# Altium schematic sheet Sheet2.SchDoc
size 381 x 241 mm
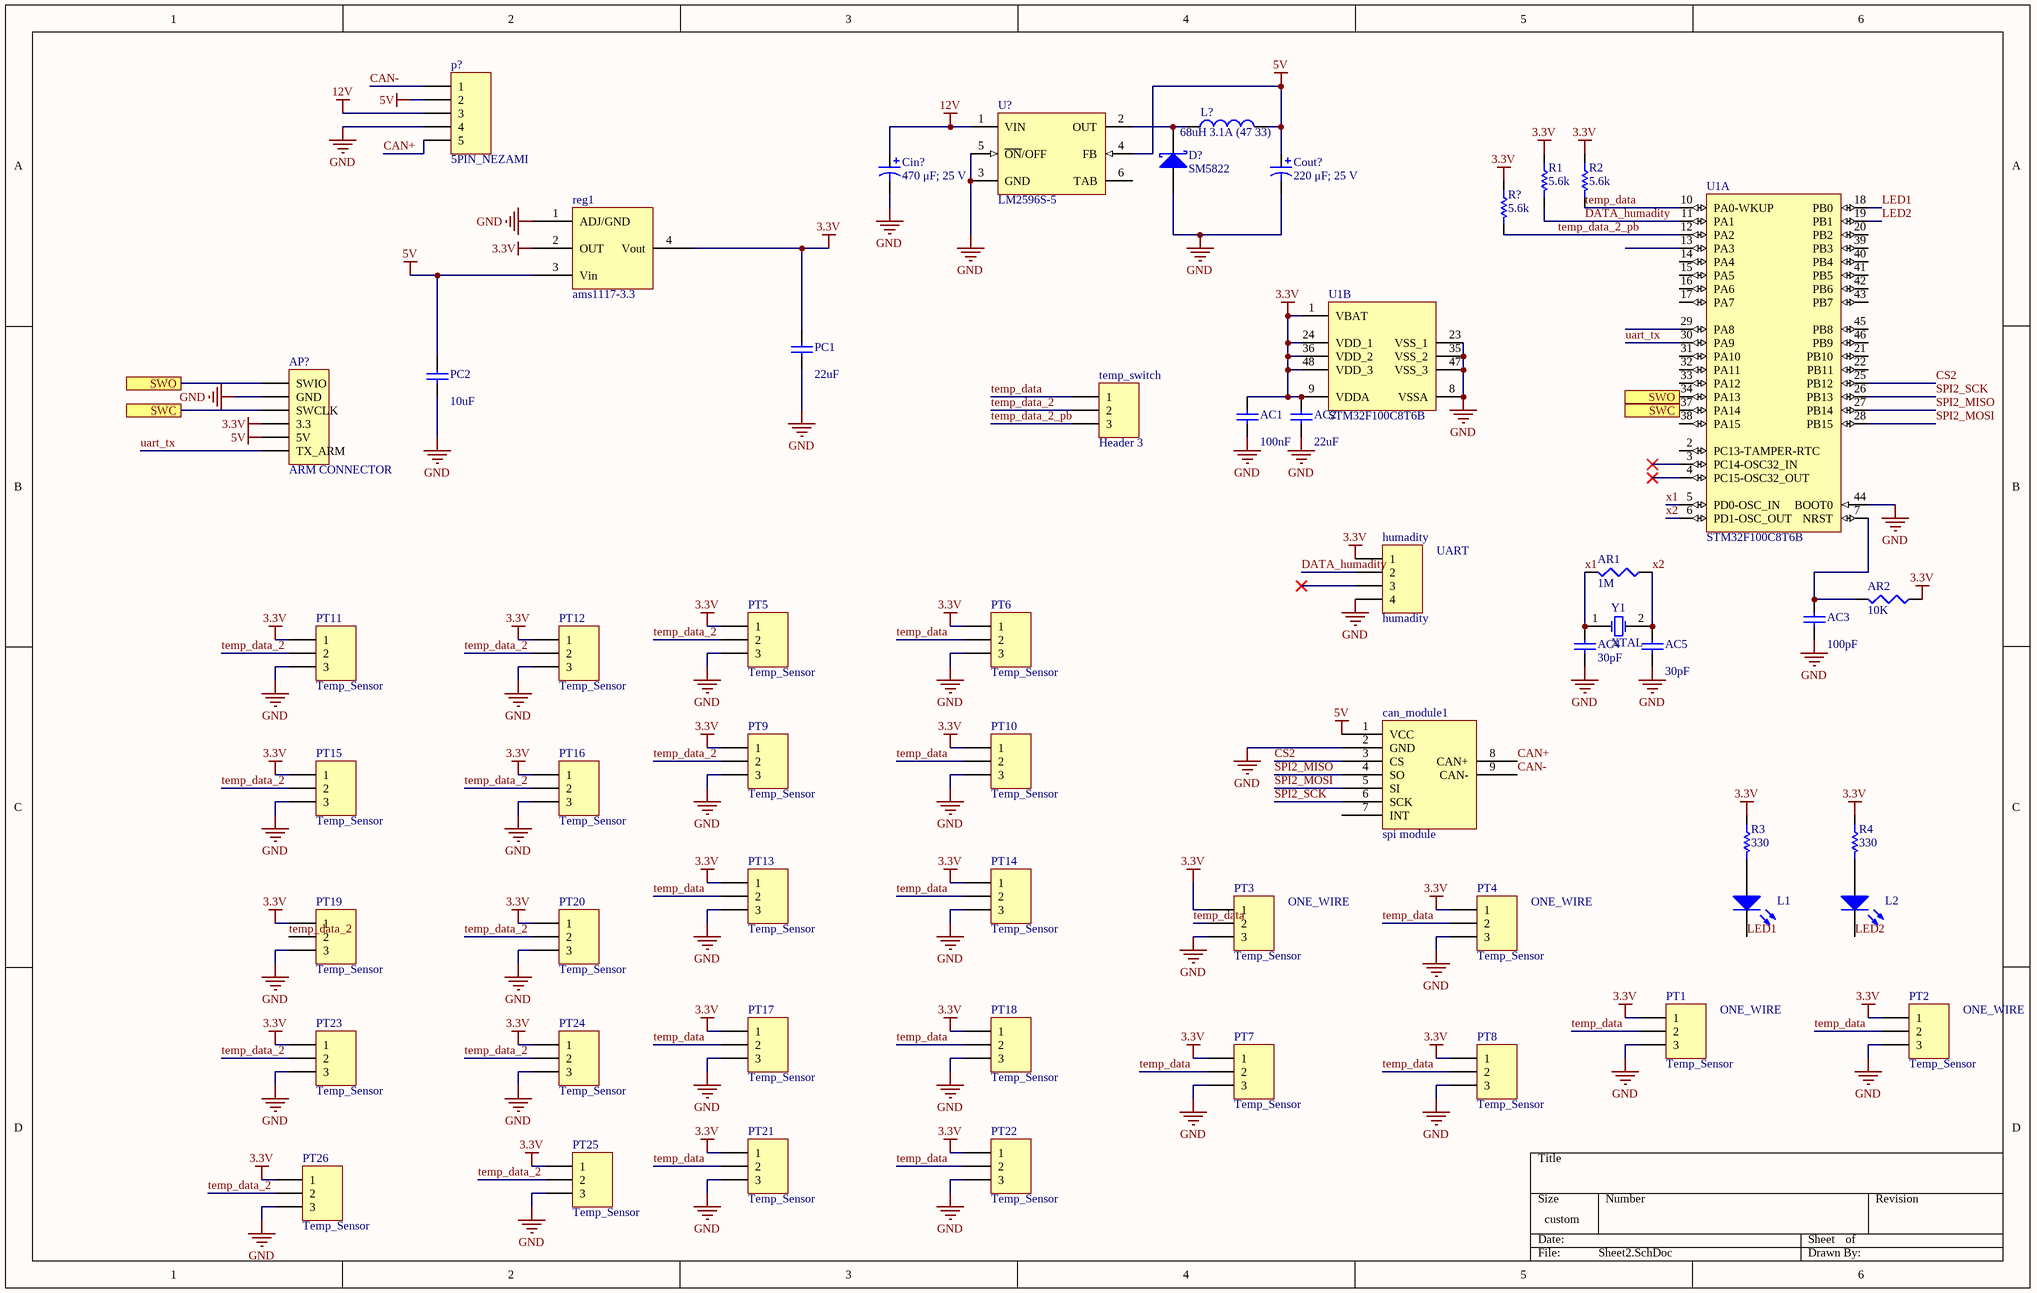
[diagram p0: Sheet2.SchDoc]

## Parts
AC1  value 100nF  [C1206]  (hidden comment: Cap Semi)
AC2  value 22uF  [C1206]  (hidden comment: Cap Semi)
AC3  value 100pF  [C1206]  (hidden comment: Cap Semi)
AC4  value 30pF  [C1206]  (hidden comment: Cap Semi)
AC5  value 30pF  [C1206]  (hidden comment: Cap Semi)
AP?  ARM CONNECTOR  [HDR1X6]
AR1  value 1M  [c1206]  (hidden comment: Res3)
AR2  value 10K  [c1206]  (hidden comment: Res3)
can_module1  spi module  [SPI_CAN]
Cin?  470 μF; 25 V  [E]
Cout?  220 μF; 25 V  [E]
D?  SM5822  [SMB]
humadity  humadity  [HDR1X4]
L1  LED2  [C1206]  (value not drawn)
L2  LED2  [C1206]  (value not drawn)
L?  68uH 3.1A (47 33)  [CAPR5-4X5]
p?  5PIN_NEZAMI  [5PIN_NEZAMI_CAN]
PC1  value 22uF  [C1206]  (hidden comment: Cap Semi)
PC2  value 10uF  [C1206]  (hidden comment: PC1)
PT1  Temp_Sensor  [HDR1X3]
PT2  Temp_Sensor  [HDR1X3]
PT3  Temp_Sensor  [HDR1X3]
PT4  Temp_Sensor  [HDR1X3]
PT5  Temp_Sensor  [HDR1X3]
PT6  Temp_Sensor  [HDR1X3]
PT7  Temp_Sensor  [HDR1X3]
PT8  Temp_Sensor  [HDR1X3]
PT9  Temp_Sensor  [HDR1X3]
PT10  Temp_Sensor  [HDR1X3]
PT11  Temp_Sensor  [HDR1X3]
PT12  Temp_Sensor  [HDR1X3]
PT13  Temp_Sensor  [HDR1X3]
PT14  Temp_Sensor  [HDR1X3]
PT15  Temp_Sensor  [HDR1X3]
PT16  Temp_Sensor  [HDR1X3]
PT17  Temp_Sensor  [HDR1X3]
PT18  Temp_Sensor  [HDR1X3]
PT19  Temp_Sensor  [HDR1X3]
PT20  Temp_Sensor  [HDR1X3]
PT21  Temp_Sensor  [HDR1X3]
PT22  Temp_Sensor  [HDR1X3]
PT23  Temp_Sensor  [HDR1X3]
PT24  Temp_Sensor  [HDR1X3]
PT25  Temp_Sensor  [HDR1X3]
PT26  Temp_Sensor  [HDR1X3]
R1  5.6k  [1206]
R2  5.6k  [1206]
R3  330  [1206]
R4  330  [1206]
R?  5.6k  [1206]
reg1  ams1117-3.3  [SOT223_N]
temp_switch  Header 3  [HDR1X3]
U1  STM32F100C8T6B  [STM-LQFP48_N]  (parts A,B of 2)
U?  LM2596S-5  [TS5B_N]
Y1  XTAL  [RAD-0.2]

## Ports
SWC, SWO

## Nets
3.3V: AC1.1 AC2.1 AP?.4(3.3) AR2.1 humadity.1 PC1.1 PT1.1 PT2.1 PT3.1 PT4.1 PT5.1 PT6.1 PT7.1 PT8.1 PT9.1 PT10.1 PT11.1 PT12.1 PT13.1 PT14.1 PT15.1 PT16.1 PT17.1 PT18.1 PT19.1 PT20.1 PT21.1 PT22.1 PT23.1 PT24.1 PT25.1 PT26.1 R1.1 R2.1 R3.1 R4.1 R?.1 reg1.2(OUT) reg1.4(Vout) U1.1(VBAT) U1.9(VDDA) U1.24(VDD_1) U1.36(VDD_2) U1.48(VDD_3)
5V: AP?.5(5V) can_module1.1(VCC) Cout?.1 L?.2 p?.2 PC2.1 reg1.3(Vin) U?.4(FB)
12V: Cin?.1 p?.3 U?.1(VIN)
GND: AC1.2 AC2.2 AC3.2 AC4.2 AC5.2 AP?.2(GND) can_module1.2(GND) Cin?.2 Cout?.2 D?.1(A) humadity.4 p?.4 PC1.2 PC2.2 PT1.3 PT2.3 PT3.3 PT4.3 PT5.3 PT6.3 PT7.3 PT8.3 PT9.3 PT10.3 PT11.3 PT12.3 PT13.3 PT14.3 PT15.3 PT16.3 PT17.3 PT18.3 PT19.3 PT20.3 PT21.3 PT22.3 PT23.3 PT24.3 PT25.3 PT26.3 reg1.1(ADJ/GND) U1.8(VSSA) U1.23(VSS_1) U1.35(VSS_2) U1.44(BOOT0) U1.47(VSS_3) U?.3(GND) U?.5(~{ON}/OFF)
CAN+: can_module1.8(CAN+) p?.5
CAN-: can_module1.9(CAN-) p?.1
CS2: can_module1.3(CS) U1.25(PB12)
DATA_humadity: humadity.2 R1.2 U1.11(PA1)
LED1: L1.2(K) U1.18(PB0)
LED2: L2.2(K) U1.19(PB1)
SPI2_MISO: can_module1.4(SO) U1.27(PB14)
SPI2_MOSI: can_module1.5(SI) U1.28(PB15)
SPI2_SCK: can_module1.6(SCK) U1.26(PB13)
SWC: AP?.3(SWCLK) U1.37(PA14) ; port SWC
SWO: AP?.1(SWIO) U1.34(PA13) ; port SWO
temp_data: PT1.2 PT2.2 PT3.2 PT4.2 PT6.2 PT7.2 PT8.2 PT10.2 PT13.2 PT14.2 PT17.2 PT18.2 PT21.2 PT22.2 R2.2 temp_switch.1 U1.10(PA0-WKUP)
temp_data_2: PT5.2 PT9.2 PT11.2 PT12.2 PT15.2 PT16.2 PT19.2 PT20.2 PT23.2 PT24.2 PT25.2 PT26.2 temp_switch.2
temp_data_2_pb: R?.2 temp_switch.3 U1.12(PA2)
uart_tx: AP?.6(TX_ARM) U1.30(PA9)
x1: AC4.1 AR1.2 U1.5(PD0-OSC_IN) Y1.1(OSC1)
x2: AC5.1 AR1.1 U1.6(PD1-OSC_OUT) Y1.2(OSC2)
NetAC3_1: AC3.1 AR2.2 U1.7(NRST)
NetD?_2: D?.2(K) L?.1 U?.2(OUT)
NetL1_1: L1.1(A) R3.2
NetL2_1: L2.1(A) R4.2

Not connected (* = marked no-connect by the designer): can_module1 7(INT); humadity 3*; U1 2(PC13-TAMPER-RTC) 3(PC14-OSC32_IN)* 4(PC15-OSC32_OUT)* 13(PA3) 14(PA4) 15(PA5) 16(PA6) 17(PA7) 20(PB2) 21(PB10) 22(PB11) 29(PA8) 31(PA10) 32(PA11) 33(PA12) 38(PA15) 39(PB3) 40(PB4) 41(PB5) 42(PB6) 43(PB7) 45(PB8) 46(PB9); U? 6(TAB)

## Notes on the sheet
- UART
- ONE_WIRE

## Library data of the parts
AC1-AC5 PC1 PC2 = Cap Semi: Capacitor (Semiconductor SIM Model); Published: 8-Jun-2000; LatestRevisionDate: 29-May-2009; LatestRevisionNote: IPC-7351 Footprint Added.; PackageReference: C1206; Publisher: Altium Limited; PackageDescription: Chip Capacitor
AP? = Header 6: Header, 6-Pin; LatestRevisionDate: 17-Jul-2002; LatestRevisionNote: Re-released for DXP Platform.; Publisher: Altium Limited
AR1 AR2 = Res3: Resistor; Published: 8-Jun-2000; LatestRevisionDate: 29-May-2009; LatestRevisionNote: IPC-7351 Footprint Added.; PackageReference: J1-0603; Publisher: Altium Limited; PackageDescription: Chip Resistor
Cin? Cout? = 94SH107X0016EBP: Solid Aluminum Capacitor with Organic Semiconductor Electrolyte: 100uF, 16V, Bulk Pack; Note: Part Numbers shown are for ± 20% capacitance tolerance (X0).; PCB_Layout: Complies with Manufacturer's Recommendation.; DrillSize: Nominal, Rounded to the nearest 0.1mm; Published: 19-Mar-2004; DatasheetDocument: 23-May-2001; PackageReference: E; Publisher: Altium Limited; ComponentLink1Description: Manufacturer Link; ComponentLink1URL: http://www.vishay.com/; ComponentLink2Description: Datasheet; ComponentLink2URL: http://www.vishay.com/docs/90006/94sh.pdf; Value: 100uF
D? = D Schottky: Schottky Diode; Published: 8-Jun-2000; LatestRevisionDate: 17-Jul-2002; LatestRevisionNote: Re-released for DXP Platform.; PackageReference: SMB; Publisher: Altium Limited; PackageDescription: DO-214-AA/SMB; 2 C-Bend Leads; Body 5.3 x 3.6 mm, inc. leads (LxW); Code_JEDEC: DO-214-AA
humadity = Header 4: Header, 4-Pin; LatestRevisionDate: 17-Jul-2002; LatestRevisionNote: Re-released for DXP Platform.; Publisher: Altium Limited
L1 L2 = LED2: Typical RED, GREEN, YELLOW, AMBER GaAs LED; Published: 8-Jun-2000; LatestRevisionDate: 17-Jul-2002; LatestRevisionNote: Re-released for DXP Platform.; PackageVersion: Feb-2002; PackageReference: 3.2X1.6X1.1; Publisher: Altium Limited; PackageDescription: SM LED; 2 Flat Leads
L? = Inductor: Code_IEC: 1005; Value: 10mH; Published: 8-Jun-2000; LatestRevisionDate: 29-May-2009; LatestRevisionNote: IPC-7351 Footprint Added.; PackageReference: 0402-A; Publisher: Altium Limited; PackageDescription: Chip Inductor; Code_JEITA: 0402
p? = 5PIN_NEZAMI: Header, 8-Pin; LatestRevisionDate: 17-Jul-2002; LatestRevisionNote: Re-released for DXP Platform.; Publisher: Altium Limited
PT1-PT26 temp_switch = Header 3: Header, 3-Pin; LatestRevisionDate: 17-Jul-2002; LatestRevisionNote: Re-released for DXP Platform.; Publisher: Altium Limited
R1-R4 R? = Resistor
  R1 R2 R?: Value: 5.6k
  R3 R4: Value: 330
U1 = STM32F100C8T6B: ARM Cortex-M3 32-bit MCU, 64 KB Flash, 8 KB Internal RAM, 37 I/Os, 48-pin LQFP, -40 to 85 degC, Tray; A/D Converter: 1x12-bit (10 Channel); D/A Converter: 2x12-bit (2 Channel); FLASH Size (Prog) (kB): 64; I/Os (High Current): 37; Internal RAM Size (kB): 8; Operating Frequency(F) (Processor speed) (MHz): 24; Supply Voltage(Vcc) min (V): 2; DatasheetVersion: Rev. 7; PackageVersion: Rev. 6, 06/2013; PackageReference: LQFP48; PackageDescription: 48-Pin Low Profile Quad Flat Package, 7 x 7 mm Body, 0.5 mm Pitch; Supplier 1: Digi-Key; Supplier Part Number 1: 497-10499-ND; Supplier 2: Farnell; Supplier Part Number 2: 1838511; Supplier 3: Newark; Supplier Part Number 3: 76R0988; Supplier 4: Mouser; Supplier Part Number 4: 511-STM32F100C8T6B; Core: ARM Cortex-M3; Packing: Tray; Mounting Technology: Surface Mount; PartNumber: STM32F100C8T6B; ComponentLink1Description: Manufacturer URL; ComponentLink1URL: http://www.st.com/web/en/home.html; ComponentLink2Description: Datasheet; ComponentLink2URL: http://www.st.com/st-web-ui/static/active/en/resource/technical/document/datasheet/CD00251732.pdf; ComponentLink3Description: Package Specification; ComponentLink3URL: http://www.st.com/st-web-ui/static/active/en/resource/technical/document/datasheet/DM00058181.pdf
U? = LM2596S-ADJ: SIMPLE SWITCHER® Power Converter 150 KHz 3A Step-Down Voltage Regulator, 5-pin TO-263; Manufacturer: National Semiconductor; PackageTopMarking: NSUZXYTTE#*LM2596S*-ADJ P+; PowerWise: N; Published: 4-Dec-2008; DatasheetVersion: May-2002; PackageVersion: revD, Apr-2005; PackageReference: TS5B; Publisher: Altium Limited; PackageDescription: TO-263, Molded, .400 x .390 x .180in, 5 Lead, .067in Pitch, Surface Mount; Supplier 1: Farnell; Supplier Part Number 1: 1523864; Supplier 2: Farnell; Supplier Part Number 2: 9494367; PartNumber: LM2596S-ADJ; RoHS: N; PinCount: 5; CompType: Switcher; Code_JEDEC: MO-169-AB; ComponentLink1Description: LM2596 Datasheet; ComponentLink1URL: http://www.national.com/ds/LM/LM2596.pdf; ComponentLink2Description: LM2596 Web Page; ComponentLink2URL: http://www.national.com/pf/LM/LM2596.html; ComponentLink3Description: TS5B Package Page; ComponentLink3URL: http://www.national.com/packaging/folders/ts5b.html
Y1 = XTAL: Crystal Oscillator; Published: 8-Jun-2000; LatestRevisionDate: 17-Jul-2002; LatestRevisionNote: Re-released for DXP Platform.; PackageReference: R38; Publisher: Altium Limited; PackageDescription: Crystal, Thru-Hole; 2 Leads; Body 3.1 x 8.2 mm (Dia.xH)